# Altium project PCB_Project1.PrjPCB
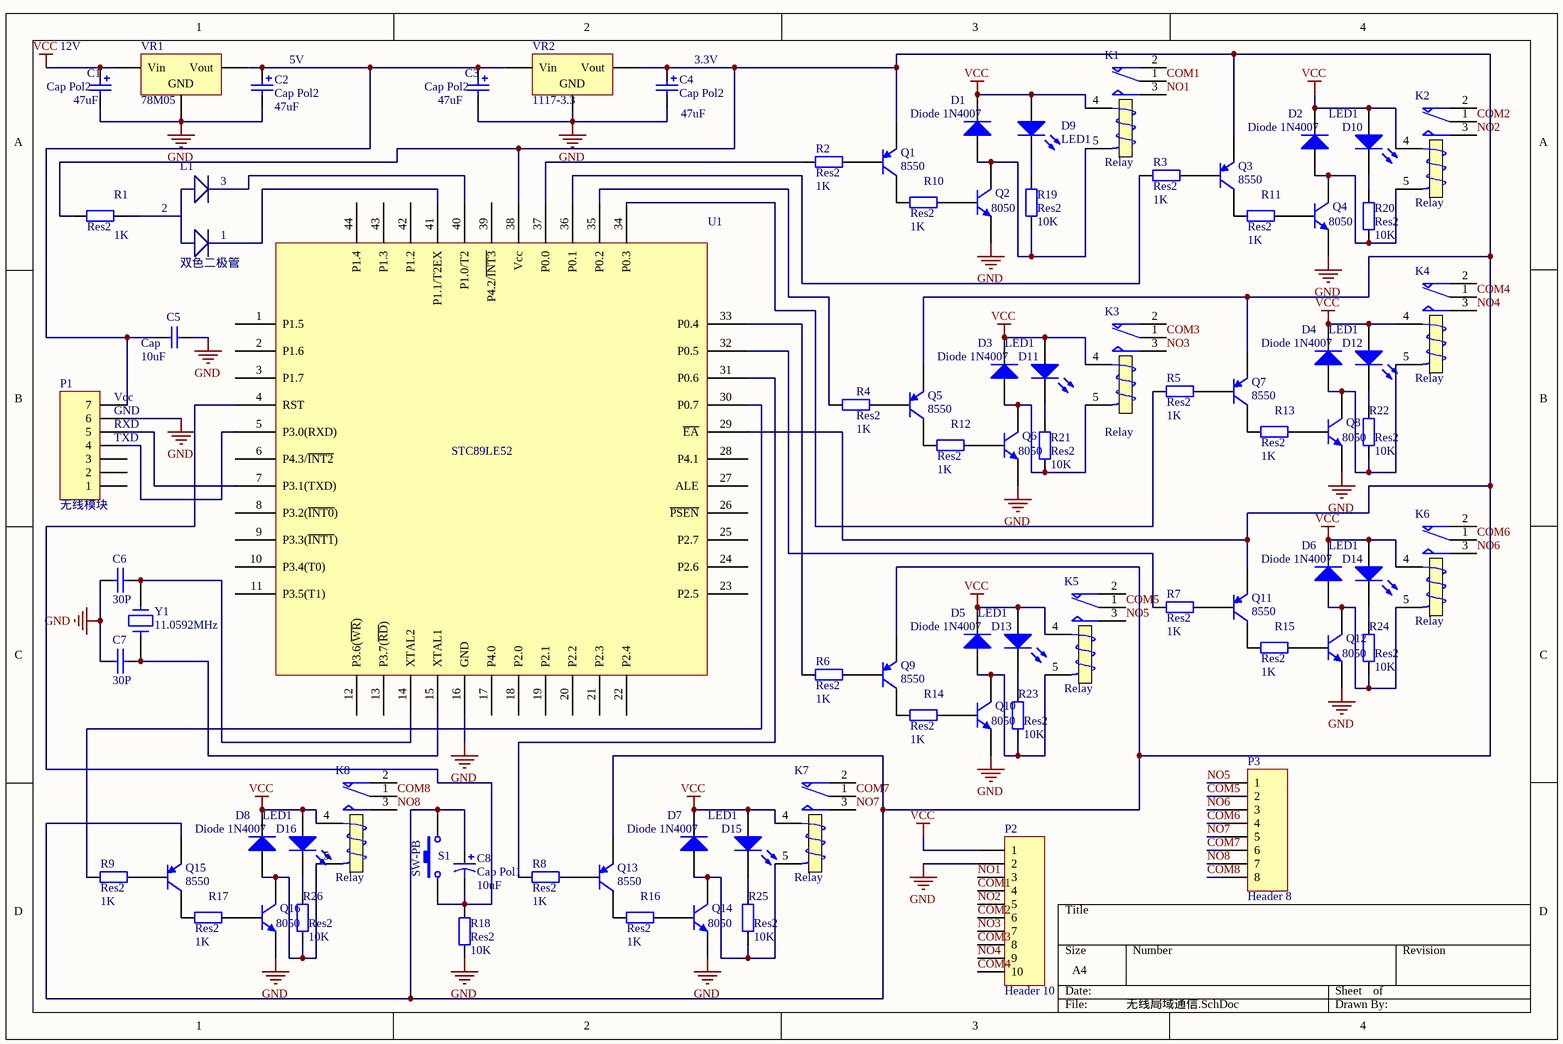
[diagram p0: 无线局域通信.SchDoc]
1 sheet, 83 parts. Net scope: global (net labels, ports and power ports of the same name join across sheets).

## Sheet 无线局域通信.SchDoc
size A4

### Parts
C1  Cap Pol2  value 47uF  [CAP_D6_3MM]
C2  Cap Pol2  value 47uF  [CAP_D6_3MM]
C3  Cap Pol2  value 47uF  [CAP_D6_3MM]
C4  Cap Pol2  value 47uF  [CAP_D6_3MM]
C5  Cap  value 10uF  [RAD0.1]
C6  30P  [0603]
C7  30P  [0603]
C8  Cap Pol1  value 10uF  [CAP_D6_3MM]
D1  Diode 1N4007  [DO-41]
D2  Diode 1N4007  [DO-41]
D3  Diode 1N4007  [DO-41]
D4  Diode 1N4007  [DO-41]
D5  Diode 1N4007  [DO-41]
D6  Diode 1N4007  [DO-41]
D7  Diode 1N4007  [DO-41]
D8  Diode 1N4007  [DO-41]
D9  LED1  [LED-1]
D10  LED1  [LED-1]
D11  LED1  [LED-1]
D12  LED1  [LED-1]
D13  LED1  [LED-1]
D14  LED1  [LED-1]
D15  LED1  [LED-1]
D16  LED1  [LED-1]
K1  Relay  [继电器]
K2  Relay  [继电器]
K3  Relay  [继电器]
K4  Relay  [继电器]
K5  Relay  [继电器]
K6  Relay  [继电器]
K7  Relay  [继电器]
K8  Relay  [继电器]
L1  双色二极管  [TO-205AF]
P1  无线模块  [P1]
P2  Header 10  [P2]
P3  Header 8  [P3]
Q1  8550  [SOT-23B_N]
Q2  8050  [SOT-23B_N]
Q3  8550  [SOT-23B_N]
Q4  8050  [SOT-23B_N]
Q5  8550  [SOT-23B_N]
Q6  8050  [SOT-23B_N]
Q7  8550  [SOT-23B_N]
Q8  8050  [SOT-23B_N]
Q9  8550  [SOT-23B_N]
Q10  8050  [SOT-23B_N]
Q11  8550  [SOT-23B_N]
Q12  8050  [SOT-23B_N]
Q13  8550  [SOT-23B_N]
Q14  8050  [SOT-23B_N]
Q15  8550  [SOT-23B_N]
Q16  8050  [SOT-23B_N]
R1  Res2  value 1K  [0603]
R2  Res2  value 1K  [0603]
R3  Res2  value 1K  [0603]
R4  Res2  value 1K  [0603]
R5  Res2  value 1K  [0603]
R6  Res2  value 1K  [0603]
R7  Res2  value 1K  [0603]
R8  Res2  value 1K  [0603]
R9  Res2  value 1K  [0603]
R10  Res2  value 1K  [0603]
R11  Res2  value 1K  [0603]
R12  Res2  value 1K  [0603]
R13  Res2  value 1K  [0603]
R14  Res2  value 1K  [0603]
R15  Res2  value 1K  [0603]
R16  Res2  value 1K  [0603]
R17  Res2  value 1K  [0603]
R18  Res2  value 10K  [0603]
R19  Res2  value 10K  [0603]
R20  Res2  value 10K  [0603]
R21  Res2  value 10K  [0603]
R22  Res2  value 10K  [0603]
R23  Res2  value 10K  [0603]
R24  Res2  value 10K  [0603]
R25  Res2  value 10K  [0603]
R26  Res2  value 10K  [0603]
S1  SW-PB  [轻触开关]
U1  STC89LE52  [LQFP44_10X10X08P]
VR1  78M05  [TO-252-2L]
VR2  1117-3.3  [SOT-223]
Y1  11.0592MHz  [49S]

### Nets
GND: C1.2 C2.2 C3.2 C4.2 C5.2 C6.1 C7.1 P1.6 P2.2 Q2.2(E) Q4.2(E) Q6.2(E) Q8.2(E) Q10.2(E) Q12.2(E) Q14.2(E) Q16.2(E) R18.1 U1.16(GND) VR1.2(GND) VR2.1(GND)
VCC: C1.1 D1.1(K) D2.1(K) D3.1(K) D4.1(K) D5.1(K) D6.1(K) D7.1(K) D8.1(K) D9.1(A) D10.1(A) D11.1(A) D12.1(A) D13.1(A) D14.1(A) D15.1(A) D16.1(A) K1.4(T1) K2.4(T1) K3.4(T1) K4.4(T1) K5.4(T1) K6.4(T1) K7.4(T1) K8.4(T1) P2.1 VR1.1(Vin)
COM1: K1.1(COM) P2.4
COM2: K2.1(COM) P2.6
COM3: K3.1(COM) P2.8
COM4: K4.1(COM) P2.10
COM5: K5.1(COM) P3.2
COM6: K6.1(COM) P3.4
COM7: K7.1(COM) P3.6
COM8: K8.1(COM) P3.8
NO1: K1.3(NO) P2.3
NO2: K2.3(NO) P2.5
NO3: K3.3(NO) P2.7
NO4: K4.3(NO) P2.9
NO5: K5.3(NO) P3.1
NO6: K6.3(NO) P3.3
NO7: K7.3(NO) P3.5
NO8: K8.3(NO) P3.7
NetC2_1: C2.1 C3.1 C5.1 P1.7 VR1.3(Vout) VR2.3(Vin)
NetC4_1: C4.1 C8.1 Q1.2(E) Q3.2(E) Q5.2(E) Q7.2(E) Q9.2(E) Q11.2(E) Q13.2(E) Q15.2(E) R1.1 S1.2 U1.29(~{EA}) U1.38(Vcc) VR2.2(Vout)
NetC6_2: C6.2 U1.14(XTAL2) Y1.1
NetC7_2: C7.2 U1.15(XTAL1) Y1.2
NetC8_2: C8.2 R18.2 S1.1 U1.4(RST)
NetD1_2: D1.2(A) K1.5(T2) Q2.3(C) R19.1
NetD2_2: D2.2(A) K2.5(T2) Q4.3(C) R20.1
NetD3_2: D3.2(A) K3.5(T2) Q6.3(C) R21.1
NetD4_2: D4.2(A) K4.5(T2) Q8.3(C) R22.1
NetD5_2: D5.2(A) K5.5(T2) Q10.3(C) R23.1
NetD6_2: D6.2(A) K6.5(T2) Q12.3(C) R24.1
NetD7_2: D7.2(A) K7.5(T2) Q14.3(C) R25.1
NetD8_2: D8.2(A) K8.5(T2) Q16.3(C) R26.1
NetD9_2: D9.2(K) R19.2
NetD10_2: D10.2(K) R20.2
NetD11_2: D11.2(K) R21.2
NetD12_2: D12.2(K) R22.2
NetD13_2: D13.2(K) R23.2
NetD14_2: D14.2(K) R24.2
NetD15_2: D15.2(K) R25.2
NetD16_2: D16.2(K) R26.2
NetL1_1: L1.1 U1.41(P1.1/T2EX)
NetL1_2: L1.2 R1.2
NetL1_3: L1.3 U1.40(P1.0/T2)
NetP1_4: P1.4 U1.5(P3.0(RXD))
NetP1_5: P1.5 U1.7(P3.1(TXD))
NetQ1_1: Q1.1(B) R2.2
NetQ1_3: Q1.3(C) R10.1
NetQ2_1: Q2.1(B) R10.2
NetQ3_1: Q3.1(B) R3.2
NetQ3_3: Q3.3(C) R11.1
NetQ4_1: Q4.1(B) R11.2
NetQ5_1: Q5.1(B) R4.2
NetQ5_3: Q5.3(C) R12.1
NetQ6_1: Q6.1(B) R12.2
NetQ7_1: Q7.1(B) R5.2
NetQ7_3: Q7.3(C) R13.1
NetQ8_1: Q8.1(B) R13.2
NetQ9_1: Q9.1(B) R6.2
NetQ9_3: Q9.3(C) R14.1
NetQ10_1: Q10.1(B) R14.2
NetQ11_1: Q11.1(B) R7.2
NetQ11_3: Q11.3(C) R15.1
NetQ12_1: Q12.1(B) R15.2
NetQ13_1: Q13.1(B) R8.2
NetQ13_3: Q13.3(C) R16.1
NetQ14_1: Q14.1(B) R16.2
NetQ15_1: Q15.1(B) R9.2
NetQ15_3: Q15.3(C) R17.1
NetQ16_1: Q16.1(B) R17.2
NetR2_1: R2.1 U1.37(P0.0)
NetR3_1: R3.1 U1.36(P0.1)
NetR4_1: R4.1 U1.35(P0.2)
NetR5_1: R5.1 U1.34(P0.3)
NetR6_1: R6.1 U1.33(P0.4)
NetR7_1: R7.1 U1.32(P0.5)
NetR8_1: R8.1 U1.31(P0.6)
NetR9_1: R9.1 U1.30(P0.7)

Not connected (* = marked no-connect by the designer): K1 2(NC); K2 2(NC); K3 2(NC); K4 2(NC); K5 2(NC); K6 2(NC); K7 2(NC); K8 2(NC); P1 1 2 3; U1 1(P1.5) 2(P1.6) 3(P1.7) 6(P4.3/~{INT2}) 8(P3.2(~{INT0})) 9(P3.3(~{INT1})) 10(P3.4(T0)) 11(P3.5(T1)) 12(P3.6(~{WR})) 13(P3.7(~{RD})) 17(P4.0) 18(P2.0) 19(P2.1) 20(P2.2) 21(P2.3) 22(P2.4) 23(P2.5) 24(P2.6) 25(P2.7) 26(~{PSEN}) 27(ALE) 28(P4.1) 39(P4.2/~{INT3}) 42(P1.2) 43(P1.3) 44(P1.4)

### Notes on the sheet
- (near C1) 12V
- (near C2) 5V
- (near C4) 3.3V
- (near P1) Vcc
- (near P1) GND
- (near P1) RXD
- (near P1) TXD

### Library data of the parts
C1-C4 = Cap Pol2: Polarized Capacitor (Axial); Published: 8-Jun-2000; LatestRevisionDate: 17-Jul-2002; LatestRevisionNote: Re-released for DXP Platform.; PackageReference: POLAR0.8; Publisher: Altium Limited; PackageDescription: Polarized Capacitor; 2 Leads
C5 = Cap: Capacitor; Published: 8-Jun-2000; LatestRevisionDate: 17-Jul-2002; LatestRevisionNote: Re-released for DXP Platform.; PackageReference: RAD-0.3; Publisher: Altium Limited; PackageDescription: Radial Cap, Thru-Hole; 2 Leads; 0.3 in Pin Spacing
C6 C7 = MY_C_CAP: Capacitor
C8 = Cap Pol1: Polarized Capacitor (Radial); Published: 8-Jun-2000; LatestRevisionDate: 17-Jul-2002; LatestRevisionNote: Re-released for DXP Platform.; PackageReference: RB7.6-15; Publisher: Altium Limited; PackageDescription: Polarized Capacitor (Radial); 2 Leads
D1-D8 = Diode 1N4007: 1 Amp General Purpose Rectifier; Published: 8-Jun-2000; LatestRevisionDate: 17-Jul-2002; LatestRevisionNote: Re-released for DXP Platform.; DatasheetVersion: 1998; PackageVersion: Aug-1999; PackageReference: DO-41; Publisher: Altium Limited; PackageDescription: Diode, Axial; Body 5.2 x 2.7 mm (LxDia. max), Lead Dia. 0.86 mm (max); Code_JEDEC: DO-204-AL; ComponentLink1Description: Manufacturer Link; ComponentLink1URL: http://www.fairchildsemi.com/; ComponentLink2Description: Datasheet; ComponentLink2URL: http://www.fairchildsemi.com/ds/1N%2F1N4001.pdf
D9-D16 = LED1: Typical RED GaAs LED; Published: 8-Jun-2000; LatestRevisionDate: 08-Jul-2005; LatestRevisionNote: Mech Layer 1 removed.; PackageReference: LED-1; Publisher: Altium Limited; PackageDescription: LED; 2 Leads
K1-K8 = Relay: SPDT Relay; Published: 8-Jun-2000; LatestRevisionDate: 17-Jul-2002; LatestRevisionNote: Re-released for DXP Platform.; PackageReference: MODULE5B; Publisher: Altium Limited
P1 = MHDR1X7: Header, 7-Pin; LatestRevisionDate: 17-Jul-2002; LatestRevisionNote: Re-released for DXP Platform.; Publisher: Altium Limited
P2 = Header 10: Header, 10-Pin; LatestRevisionDate: 17-Jul-2002; LatestRevisionNote: Re-released for DXP Platform.; Publisher: Altium Limited
P3 = Header 8: Header, 8-Pin; LatestRevisionDate: 17-Jul-2002; LatestRevisionNote: Re-released for DXP Platform.; Publisher: Altium Limited
Q1 Q3 Q5 Q7 Q9 Q11 Q13 Q15 = PNP: PNP Bipolar Transistor; Published: 8-Jun-2000; LatestRevisionDate: 29-May-2009; LatestRevisionNote: IPC-7351 Footprint Added.; PackageVersion: Aug-1999; PackageReference: SOT-23B; Publisher: Altium Limited; PackageDescription: 3-Pin SOT-23 Package 0.95 mm Pitch, 2.4 mm Lead Span
Q2 Q4 Q6 Q8 Q10 Q12 Q14 Q16 = QNPN: NPN Bipolar Transistor; Published: 8-Jun-2000; LatestRevisionDate: 29-May-2009; LatestRevisionNote: IPC-7351 Footprint Added.; PackageVersion: Aug-1999; PackageReference: SOT-23B; Publisher: Altium Limited; PackageDescription: 3-Pin SOT-23 Package 0.95 mm Pitch, 2.4 mm Lead Span
R1-R26 = Res2: Resistor; Published: 8-Jun-2000; LatestRevisionDate: 17-Jul-2002; LatestRevisionNote: Re-released for DXP Platform.; PackageReference: AXIAL-0.4; Publisher: Altium Limited; PackageDescription: Axial Device, Thru-Hole; 2 Leads; 0.4 in Pin Spacing
S1 = SW-PB: Switch; Published: 24-Mar-1999; LatestRevisionDate: 17-Jul-2002; LatestRevisionNote: Re-released for DXP Platform.; PackageReference: SPST-2; Publisher: Altium Limited; PackageDescription: Switch; 2 Leads
VR1 VR2 = Volt Reg: Voltage Regulator; Published: 24-Mar-1999; LatestRevisionDate: 29-May-2009; LatestRevisionNote: IPC-7351 Footprint Added.; PackageReference: D2PAK; Publisher: Altium Limited; PackageDescription: 3-Pin Transistor Outline Package 2.54 mm Pitch, 15.1 mm Lead Span
Y1 = CRYSTAL